# EasyEDA schematic SCH_USB_HUB_2025-04-28.json
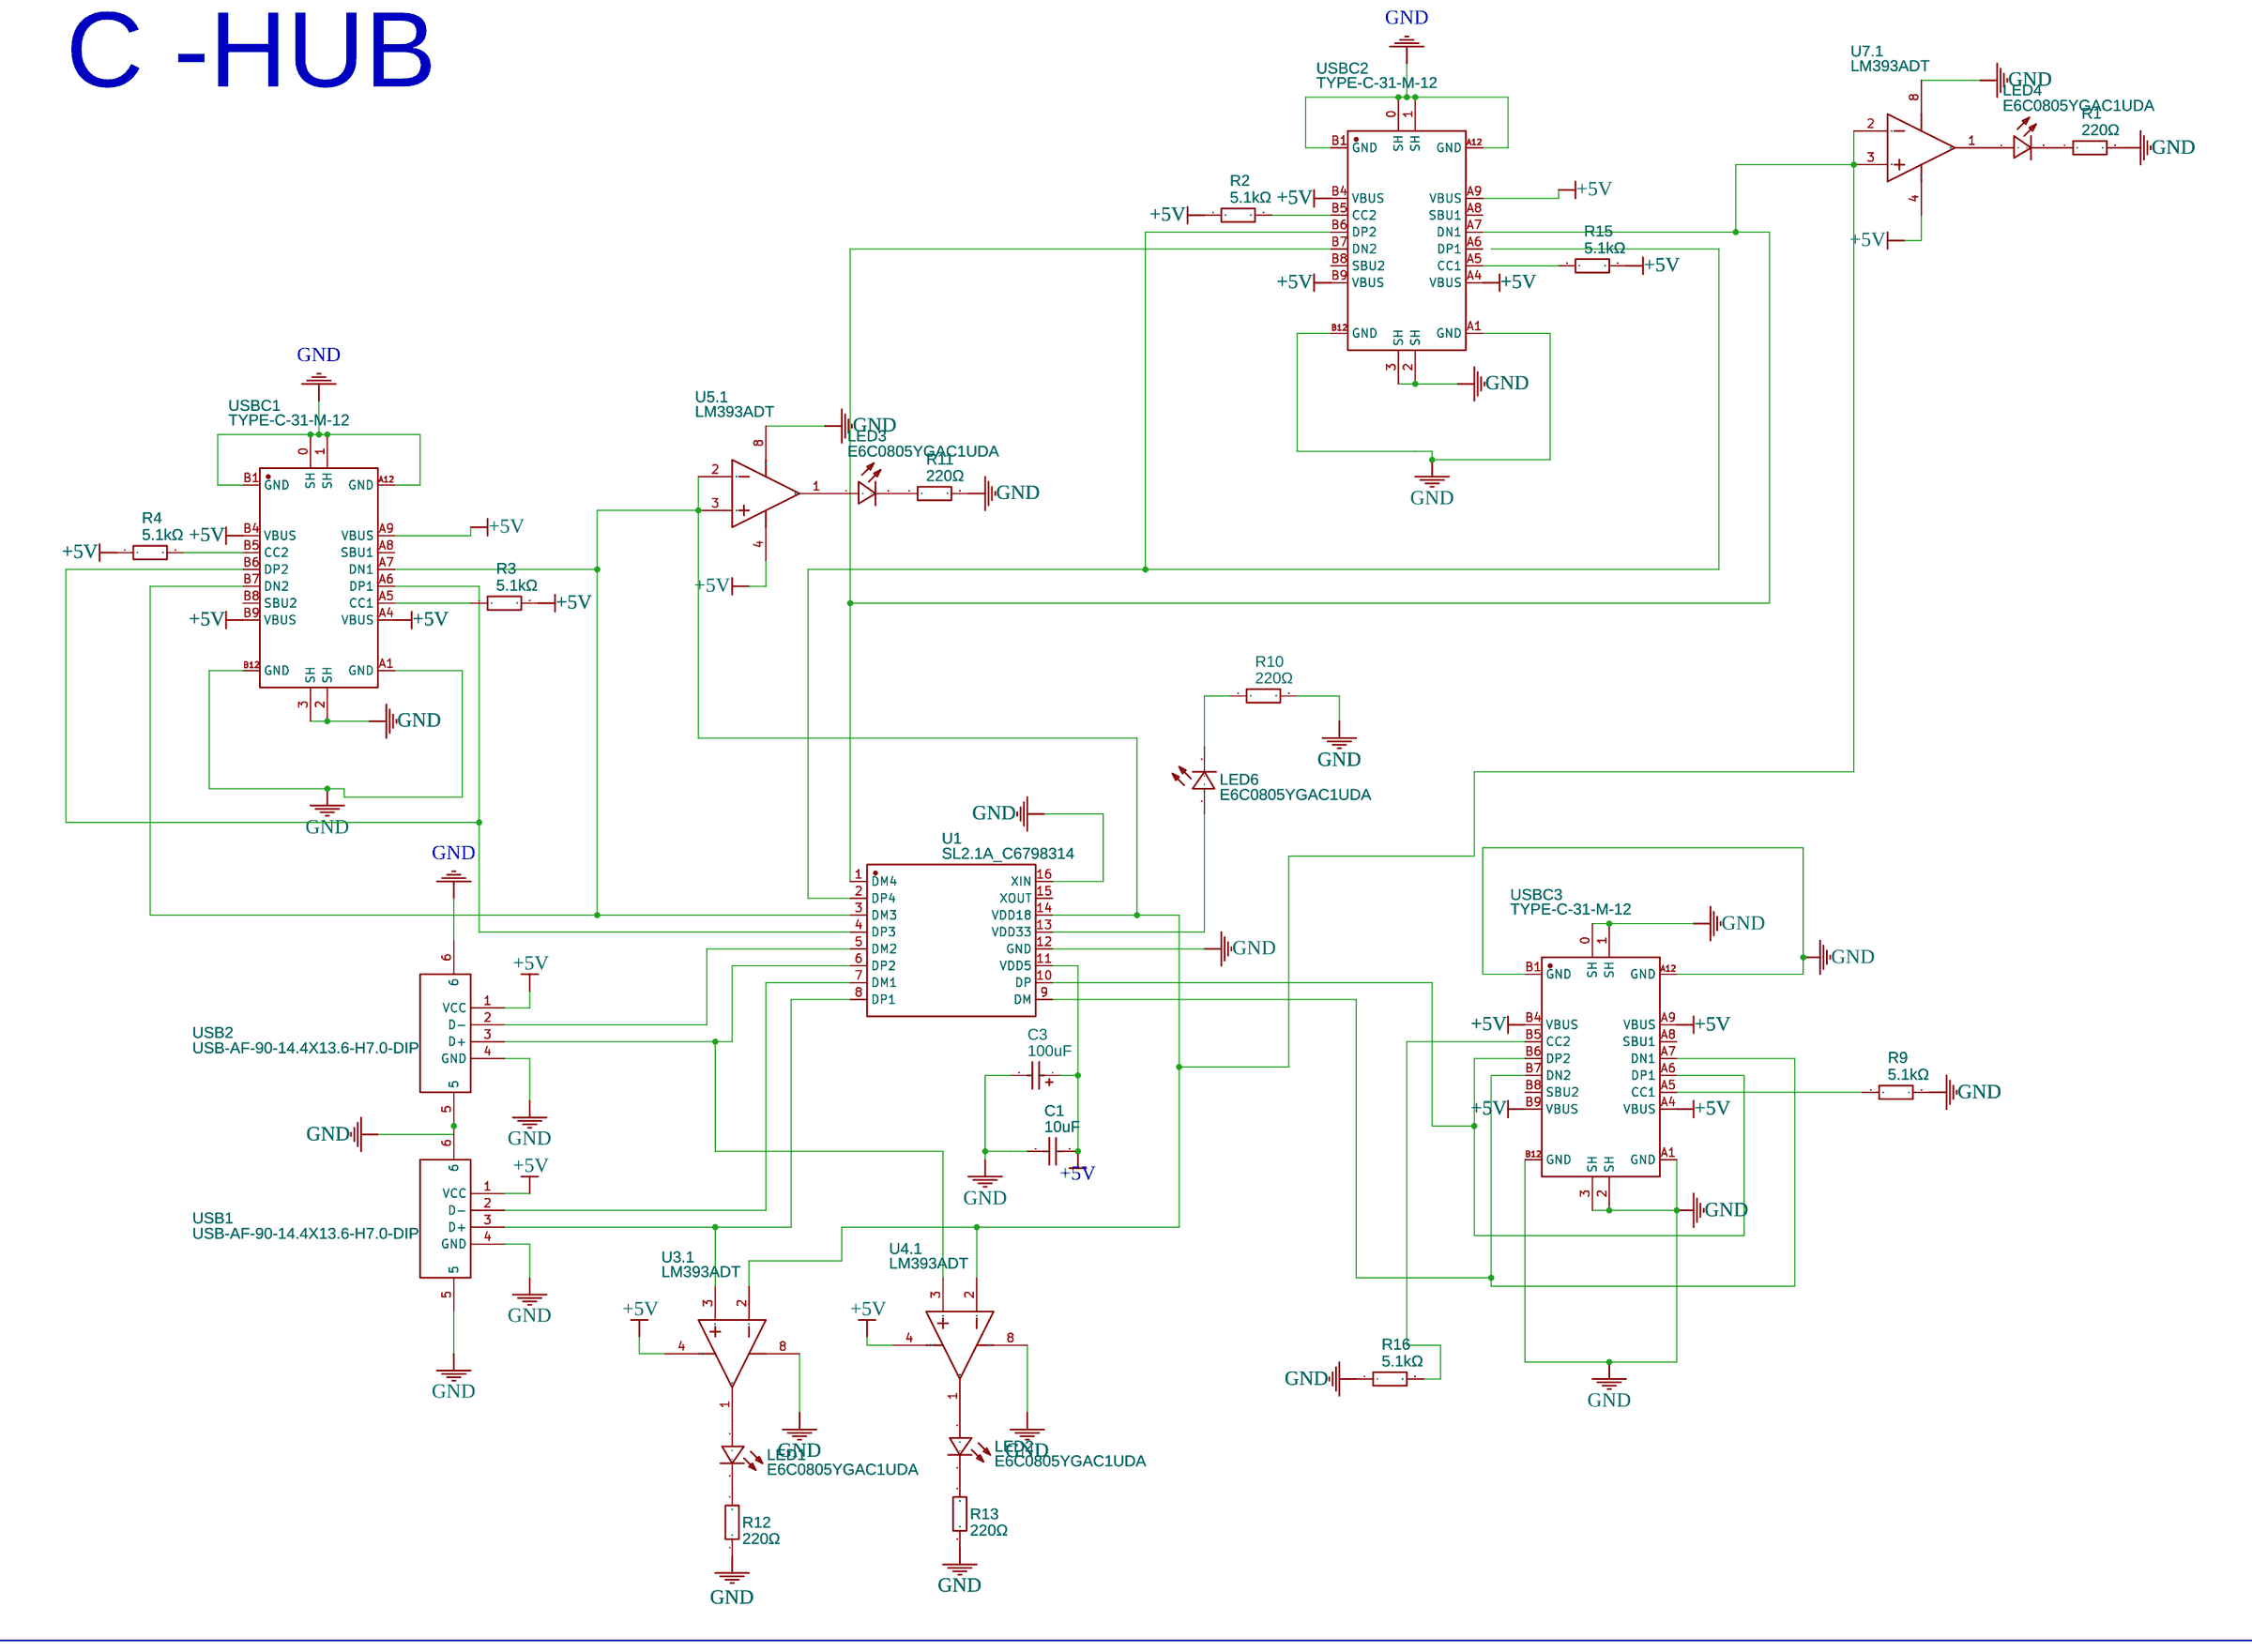
[diagram p0: schematic sheet]

## Parts
C1  10uF  [C1206]
C3  100uF  [CASE-B_3528]
LED1  E6C0805YGAC1UDA  [LED-SMD_L2.0-W1.3-R-RD]
LED2  E6C0805YGAC1UDA  [LED-SMD_L2.0-W1.3-R-RD]
LED3  E6C0805YGAC1UDA  [LED-SMD_L2.0-W1.3-R-RD]
LED4  E6C0805YGAC1UDA  [LED-SMD_L2.0-W1.3-R-RD]
LED6  E6C0805YGAC1UDA  [LED-SMD_L2.0-W1.3-R-RD]
R1  220Ω  [R0402]
R2  5.1kΩ  [R0603]
R3  5.1kΩ  [R0603]
R4  5.1kΩ  [R0603]
R9  5.1kΩ  [R0603]
R10  220Ω  [R0402]
R11  220Ω  [R0402]
R12  220Ω  [R0402]
R13  220Ω  [R0402]
R15  5.1kΩ  [R0603]
R16  5.1kΩ  [R0603]
U1  SL2.1A_C6798314  [SOP-16_L10.0-W3.9-P1.27-LS6.0-BL]
U3  LM393ADT  [SOIC-8_L4.9-W3.9-P1.27-LS6.0-BL]  (section 1)
U4  LM393ADT  [SOIC-8_L4.9-W3.9-P1.27-LS6.0-BL]  (section 1)
U5  LM393ADT  [SOIC-8_L4.9-W3.9-P1.27-LS6.0-BL]  (section 1)
U7  LM393ADT  [SOIC-8_L4.9-W3.9-P1.27-LS6.0-BL]  (section 1)
USB1  USB-AF-90-14.4X13.6-H7.0-DIP  [USB-A-TH_C46407]
USB2  USB-AF-90-14.4X13.6-H7.0-DIP  [USB-A-TH_C46407]
USBC1  TYPE-C-31-M-12  [USB-C_SMD-TYPE-C-31-M-12]
USBC2  TYPE-C-31-M-12  [USB-C_SMD-TYPE-C-31-M-12]
USBC3  TYPE-C-31-M-12  [USB-C_SMD-TYPE-C-31-M-12]

## Library data of the parts
C1 = CL31A106KOHNNNE: Supplier: LCSC; Manufacturer: SAMSUNG(三星); Supplier Part: C1849; JLCPCB Part Class: Extended Part
C3 = TAJB107M010RNJ: Supplier: LCSC; Manufacturer: Kyocera AVX; Supplier Part: C7196; JLCPCB Part Class: Extended Part
LED1-LED4 LED6 = E6C0805YGAC1UDA: Contributor: LCSC; JLCPCB Part Class: Extended Part; Supplier: LCSC; Supplier Part: C375456; Manufacturer: ekinglux(亿晶源)
R1 R10-R13 = RS-02K221JT: Supplier: LCSC; Manufacturer: FH(风华); Manufacturer Part: RC-02W221JT; Supplier Part: C1111; JLCPCB Part Class: Extended Part
R2-R4 R9 R15 R16 = RC0603JR-075K1L: Supplier: LCSC; Manufacturer: YAGEO(国巨); Supplier Part: C14677; JLCPCB Part Class: Extended Part
U1 = SL2.1A_C6798314: Contributor: lcsc; Supplier: LCSC; Supplier Part: C6798314; Manufacturer: CoreChips(和芯润德); Manufacturer Part: SL2.1A; JLCPCB Part Class: Extended Part
U3-U5 U7 = LM393ADT: subpart_no: 1; Supplier Part: C136033; Supplier: LCSC; Manufacturer: ST(意法半导体); JLCPCB Part Class: Extended Part
USB1 USB2 = USB-AF-90-14.4X13.6-H7.0-DIP: Contributor: LCSC; Supplier: LCSC; Supplier Part: C46407; Manufacturer: 精拓金; Manufacturer Part: 903-131A1011D10100; JLCPCB Part Class: Extended Part
USBC1-USBC3 = TYPE-C-31-M-12: Contributor: LCSC; Supplier: LCSC; Supplier Part: C165948; Manufacturer: 韩国韩荣; JLCPCB Part Class: Extended Part

## Nets
+5V: C1.2 C3.1 R2.1 R3.2 R4.1 R15.2 U1.11(VDD5) U3.4(GND) U4.4(GND) U5.4(GND) U7.4(GND) USB1.1(VCC) USB2.1(VCC) USBC1.A4(VBUS) USBC1.A9(VBUS) USBC1.B4(VBUS) USBC1.B9(VBUS) USBC2.A4(VBUS) USBC2.A9(VBUS) USBC2.B4(VBUS) USBC2.B9(VBUS) USBC3.A4(VBUS) USBC3.A9(VBUS) USBC3.B4(VBUS) USBC3.B9(VBUS)
GND: C1.1 C3.2 R1.2 R9.2 R10.2 R11.2 R12.1 R13.1 R16.1 U1.12(GND) U1.16(XIN) U3.8(V+) U4.8(V+) U5.8(V+) U7.8(V+) USB1.4(GND) USB1.5 USB1.6 USB2.4(GND) USB2.5 USB2.6 USBC1.0(SH) USBC1.1(SH) USBC1.2(SH) USBC1.3(SH) USBC1.A1(GND) USBC1.A12(GND) USBC1.B1(GND) USBC1.B12(GND) USBC2.0(SH) USBC2.1(SH) USBC2.2(SH) USBC2.3(SH) USBC2.A1(GND) USBC2.A12(GND) USBC2.B1(GND) USBC2.B12(GND) USBC3.0(SH) USBC3.1(SH) USBC3.2(SH) USBC3.3(SH) USBC3.A1(GND) USBC3.A12(GND) USBC3.B1(GND) USBC3.B12(GND)
Net-(LED1-1): LED1.1(+) U3.1(OUT)
Net-(LED1-2): LED1.2(-) R12.2
Net-(LED2-1): LED2.1(+) U4.1(OUT)
Net-(LED2-2): LED2.2(-) R13.2
Net-(LED3-1): LED3.1(+) U5.1(OUT)
Net-(LED3-2): LED3.2(-) R11.1
Net-(LED4-1): LED4.1(+) U7.1(OUT)
Net-(LED4-2): LED4.2(-) R1.1
Net-(LED6-1): LED6.1(+) U1.13(VDD33)
Net-(LED6-2): LED6.2(-) R10.1
Net-(R2-2): R2.2 USBC2.B5(CC2)
Net-(R3-1): R3.1 USBC1.A5(CC1)
Net-(R4-2): R4.2 USBC1.B5(CC2)
Net-(R9-1): R9.1 USBC3.A5(CC1)
Net-(R15-1): R15.1 USBC2.A5(CC1)
Net-(R16-2): R16.2 USBC3.B5(CC2)
Net-(U1-1): U1.1(DM4) U1.3(DM3) U1.14(VDD18) U3.2(IN-) U4.2(IN-) U5.2(IN-) U5.3(IN+) U7.2(IN-) U7.3(IN+) USBC1.A7(DN1) USBC1.B7(DN2) USBC2.A7(DN1) USBC2.B7(DN2)
Net-(U1-2): U1.2(DP4) USBC2.B6(DP2)
Net-(U1-4): U1.4(DP3) USBC1.A6(DP1) USBC1.B6(DP2)
Net-(U1-5): U1.5(DM2) USB2.2(D-)
Net-(U1-6): U1.6(DP2) U4.3(IN+) USB2.3(D+)
Net-(U1-7): U1.7(DM1) USB1.2(D-)
Net-(U1-8): U1.8(DP1) U3.3(IN+) USB1.3(D+)
Net-(U1-9): U1.9(DM) USBC3.A7(DN1) USBC3.B7(DN2)
Net-(U1-10): U1.10(DP) USBC3.A6(DP1) USBC3.B6(DP2)

Not connected (* = marked no-connect by the designer): U1 15(XOUT); USBC1 A8(SBU1) B8(SBU2); USBC2 A6(DP1) A8(SBU1) B8(SBU2); USBC3 A8(SBU1) B8(SBU2)

## Notes on the sheet
- C -HUB
